# Altium project DeepPlankter_main.PrjPcb (part 1 of 2)
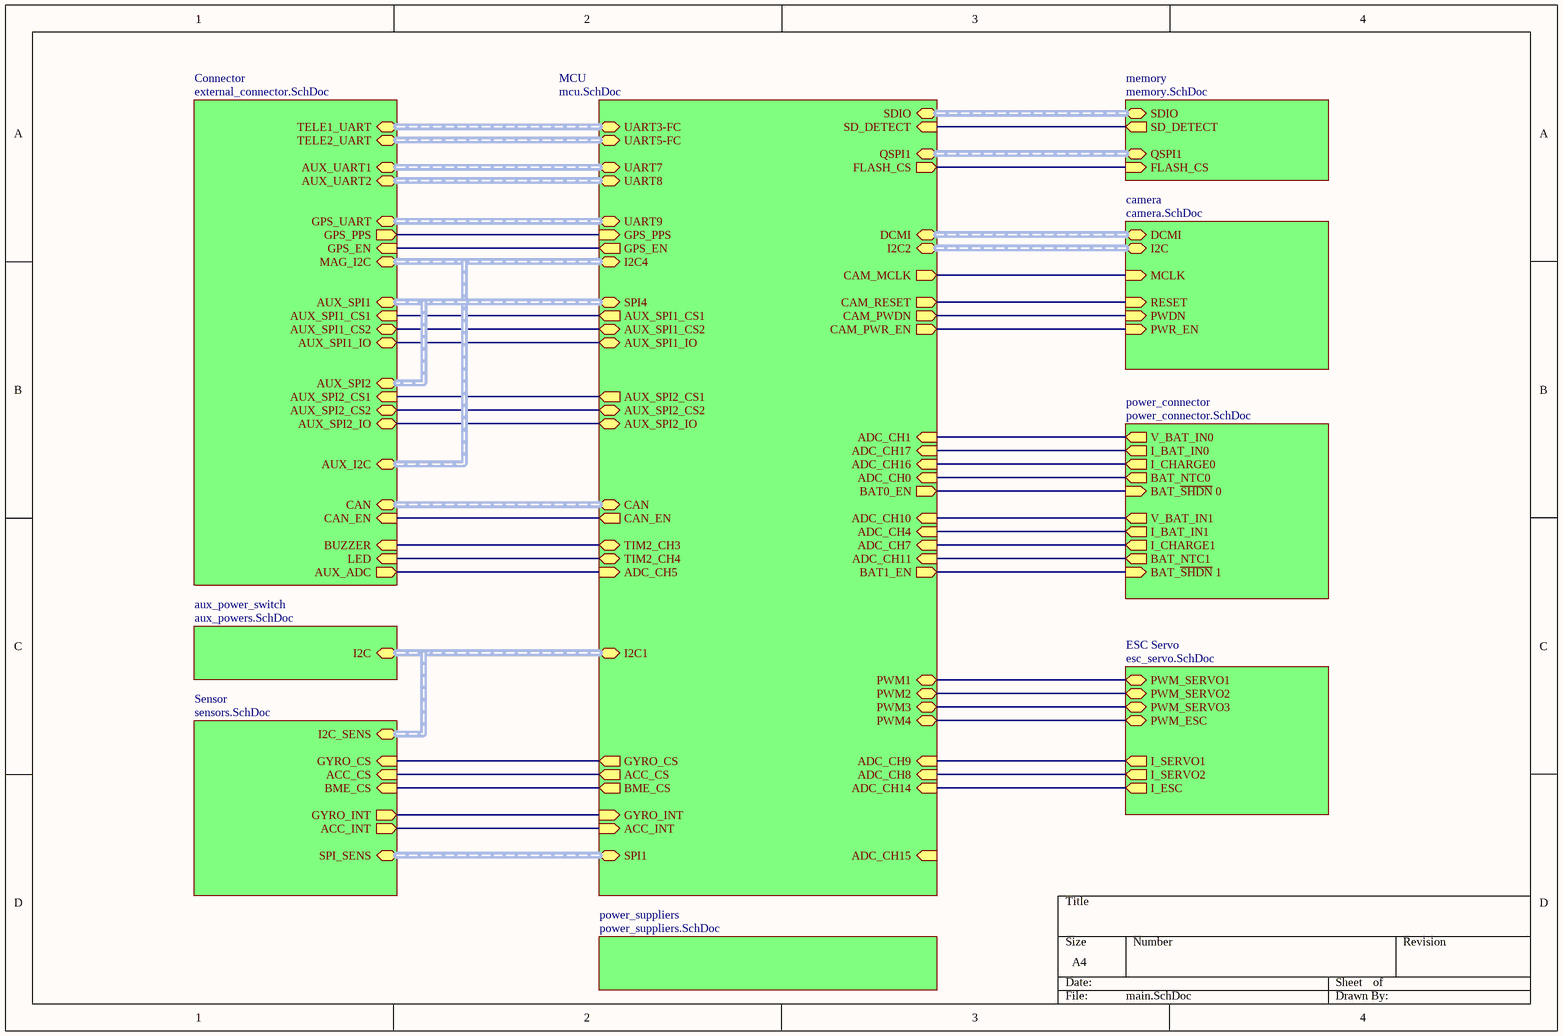
[diagram p0: main.SchDoc]
10 sheets, 257 parts. Net scope: hierarchical (ports join the sheet entries above them; power ports are global).
Board file: main.PcbDoc
Sheets:
  main.SchDoc
    MCU = mcu.SchDoc
    aux_power_switch = aux_powers.SchDoc
    Sensor = sensors.SchDoc
    Connector = external_connector.SchDoc
    power_connector = power_connector.SchDoc
    power_suppliers = power_suppliers.SchDoc
    memory = memory.SchDoc
    camera = camera.SchDoc
    ESC Servo = esc_servo.SchDoc

## Sheet main.SchDoc
size A4

### Sub-sheets
aux_power_switch = aux_powers.SchDoc: I2C (harness I2C)
camera = camera.SchDoc: DCMI (harness DCMI), RESET (in), PWDN (in), I2C (harness I2C), MCLK (in), PWR_EN (in)
Connector = external_connector.SchDoc: TELE2_UART (harness UART-FC), CAN_EN (in), AUX_UART1 (harness UART), TELE1_UART (harness UART-FC), BUZZER (in), GPS_PPS (out), MAG_I2C (harness I2C), AUX_UART2 (harness UART), AUX_I2C (harness I2C), AUX_SPI2_IO (bidir), AUX_SPI2 (harness SPI), AUX_SPI1_IO (bidir), GPS_UART (harness UART), CAN (harness CAN), AUX_SPI1 (harness SPI), GPS_EN (in), LED (in), AUX_ADC (out), AUX_SPI2_CS2 (bidir), AUX_SPI2_CS1 (in), AUX_SPI1_CS1 (in), AUX_SPI1_CS2 (bidir)
ESC Servo = esc_servo.SchDoc: I_SERVO1 (out), PWM_SERVO2, I_SERVO2 (out), PWM_ESC, I_ESC (out), PWM_SERVO1, PWM_SERVO3
MCU = mcu.SchDoc: UART5-FC (harness UART-FC), UART3-FC (harness UART-FC), UART7 (harness UART), UART8 (harness UART), UART9 (harness UART), I2C1 (harness I2C), I2C2 (harness I2C), I2C4 (harness I2C), SPI4 (harness SPI), SPI1 (harness SPI), SDIO (harness SDIO), DCMI (harness DCMI), ADC_CH14 (in), ADC_CH4 (in), ADC_CH11 (in), ADC_CH8 (in), CAN (harness CAN), CAM_RESET (out), CAM_PWDN (out), CAM_MCLK (out), CAM_PWR_EN (out), ADC_CH17 (in), ADC_CH16 (in), PWM4, PWM1, PWM3, PWM2, TIM2_CH3, TIM2_CH4, SD_DETECT (in), QSPI1 (harness QSPI), FLASH_CS (out), BAT0_EN (out), BAT1_EN (out), ADC_CH0 (in), ADC_CH10 (in), ADC_CH15 (in), ADC_CH1 (in), ADC_CH7 (in), ADC_CH5 (in), GPS_EN (out), GPS_PPS (in), AUX_SPI1_CS2 (bidir), AUX_SPI1_IO (bidir), AUX_SPI1_CS1 (out), AUX_SPI2_CS1 (out), AUX_SPI2_IO (bidir), AUX_SPI2_CS2 (bidir), CAN_EN (out), ACC_INT (in), GYRO_INT (in), ACC_CS (out), GYRO_CS (out), BME_CS (out), ADC_CH9 (in)
memory = memory.SchDoc: SDIO (harness SDIO), SD_DETECT (out), FLASH_CS (in), QSPI1 (harness QSPI)
power_connector = power_connector.SchDoc: I_CHARGE1 (out), V_BAT_IN1 (out), I_BAT_IN1 (out), BAT_NTC0 (out), I_CHARGE0 (out), V_BAT_IN0 (out), BAT_NTC1 (out), I_BAT_IN0 (out), BAT_~{SHDN} 1 (in), BAT_~{SHDN} 0 (in)
power_suppliers = power_suppliers.SchDoc: no entries
Sensor = sensors.SchDoc: GYRO_CS (in), ACC_CS (in), GYRO_INT (out), ACC_INT (out), SPI_SENS (harness SPI), I2C_SENS (harness I2C), BME_CS (in)

### Nets
ACC_CS: sheet MCU/ACC_CS, sheet Sensor/ACC_CS
ACC_INT: sheet MCU/ACC_INT, sheet Sensor/ACC_INT
ADC_CH0: sheet MCU/ADC_CH0, sheet power_connector/BAT_NTC0
ADC_CH1: sheet MCU/ADC_CH1, sheet power_connector/V_BAT_IN0
ADC_CH4: sheet MCU/ADC_CH4, sheet power_connector/I_BAT_IN1
ADC_CH5: sheet MCU/ADC_CH5, sheet Connector/AUX_ADC
ADC_CH7: sheet MCU/ADC_CH7, sheet power_connector/I_CHARGE1
ADC_CH8: sheet MCU/ADC_CH8, sheet ESC Servo/I_SERVO2
ADC_CH9: sheet MCU/ADC_CH9, sheet ESC Servo/I_SERVO1
ADC_CH10: sheet MCU/ADC_CH10, sheet power_connector/V_BAT_IN1
ADC_CH11: sheet MCU/ADC_CH11, sheet power_connector/BAT_NTC1
ADC_CH14: sheet MCU/ADC_CH14, sheet ESC Servo/I_ESC
ADC_CH16: sheet MCU/ADC_CH16, sheet power_connector/I_CHARGE0
ADC_CH17: sheet MCU/ADC_CH17, sheet power_connector/I_BAT_IN0
AUX_SPI1_CS1: sheet MCU/AUX_SPI1_CS1, sheet Connector/AUX_SPI1_CS1
AUX_SPI1_CS2: sheet MCU/AUX_SPI1_CS2, sheet Connector/AUX_SPI1_CS2
AUX_SPI1_IO: sheet MCU/AUX_SPI1_IO, sheet Connector/AUX_SPI1_IO
AUX_SPI2_CS1: sheet MCU/AUX_SPI2_CS1, sheet Connector/AUX_SPI2_CS1
AUX_SPI2_CS2: sheet MCU/AUX_SPI2_CS2, sheet Connector/AUX_SPI2_CS2
AUX_SPI2_IO: sheet MCU/AUX_SPI2_IO, sheet Connector/AUX_SPI2_IO
BAT0_EN: sheet MCU/BAT0_EN, sheet power_connector/BAT_~{SHDN} 0
BAT1_EN: sheet MCU/BAT1_EN, sheet power_connector/BAT_~{SHDN} 1
BME_CS: sheet MCU/BME_CS, sheet Sensor/BME_CS
BUZZER: sheet MCU/TIM2_CH3, sheet Connector/BUZZER
CAM_EN: sheet MCU/CAM_PWR_EN, sheet camera/PWR_EN
CAM_PWDN: sheet MCU/CAM_PWDN, sheet camera/PWDN
CAM_RESET: sheet MCU/CAM_RESET, sheet camera/RESET
CAN_EN: sheet MCU/CAN_EN, sheet Connector/CAN_EN
ESC_PWM: sheet MCU/PWM4, sheet ESC Servo/PWM_ESC
GPS_EN: sheet MCU/GPS_EN, sheet Connector/GPS_EN
GPS_PPS: sheet MCU/GPS_PPS, sheet Connector/GPS_PPS
GYRO_CS: sheet MCU/GYRO_CS, sheet Sensor/GYRO_CS
GYRO_INT: sheet MCU/GYRO_INT, sheet Sensor/GYRO_INT
LED: sheet MCU/TIM2_CH4, sheet Connector/LED
MCO_OUT: sheet MCU/CAM_MCLK, sheet camera/MCLK
QSPI1_FLASH_CS: sheet MCU/FLASH_CS, sheet memory/FLASH_CS
SD_DETECT: sheet MCU/SD_DETECT, sheet memory/SD_DETECT
SERVO1_PWM: sheet MCU/PWM1, sheet ESC Servo/PWM_SERVO1
SERVO2_PWM: sheet MCU/PWM2, sheet ESC Servo/PWM_SERVO2
SERVO3_PWM: sheet MCU/PWM3, sheet ESC Servo/PWM_SERVO3

### Buses and harness runs
harness sheet aux_power_switch/I2C = sheet MCU/I2C1 = sheet Sensor/I2C_SENS
harness sheet camera/DCMI = sheet MCU/DCMI
harness sheet camera/I2C = sheet MCU/I2C2
harness sheet Connector/AUX_I2C = sheet Connector/MAG_I2C = sheet MCU/I2C4
harness sheet Connector/AUX_SPI1 = sheet Connector/AUX_SPI2 = sheet MCU/SPI4
harness sheet Connector/AUX_UART1 = sheet MCU/UART7
harness sheet Connector/AUX_UART2 = sheet MCU/UART8
harness sheet Connector/CAN = sheet MCU/CAN
harness sheet Connector/GPS_UART = sheet MCU/UART9
harness sheet Connector/TELE1_UART = sheet MCU/UART3-FC
harness sheet Connector/TELE2_UART = sheet MCU/UART5-FC
harness sheet MCU/QSPI1 = sheet memory/QSPI1
harness sheet MCU/SDIO = sheet memory/SDIO
harness sheet MCU/SPI1 = sheet Sensor/SPI_SENS

## Sheet mcu.SchDoc
size A3
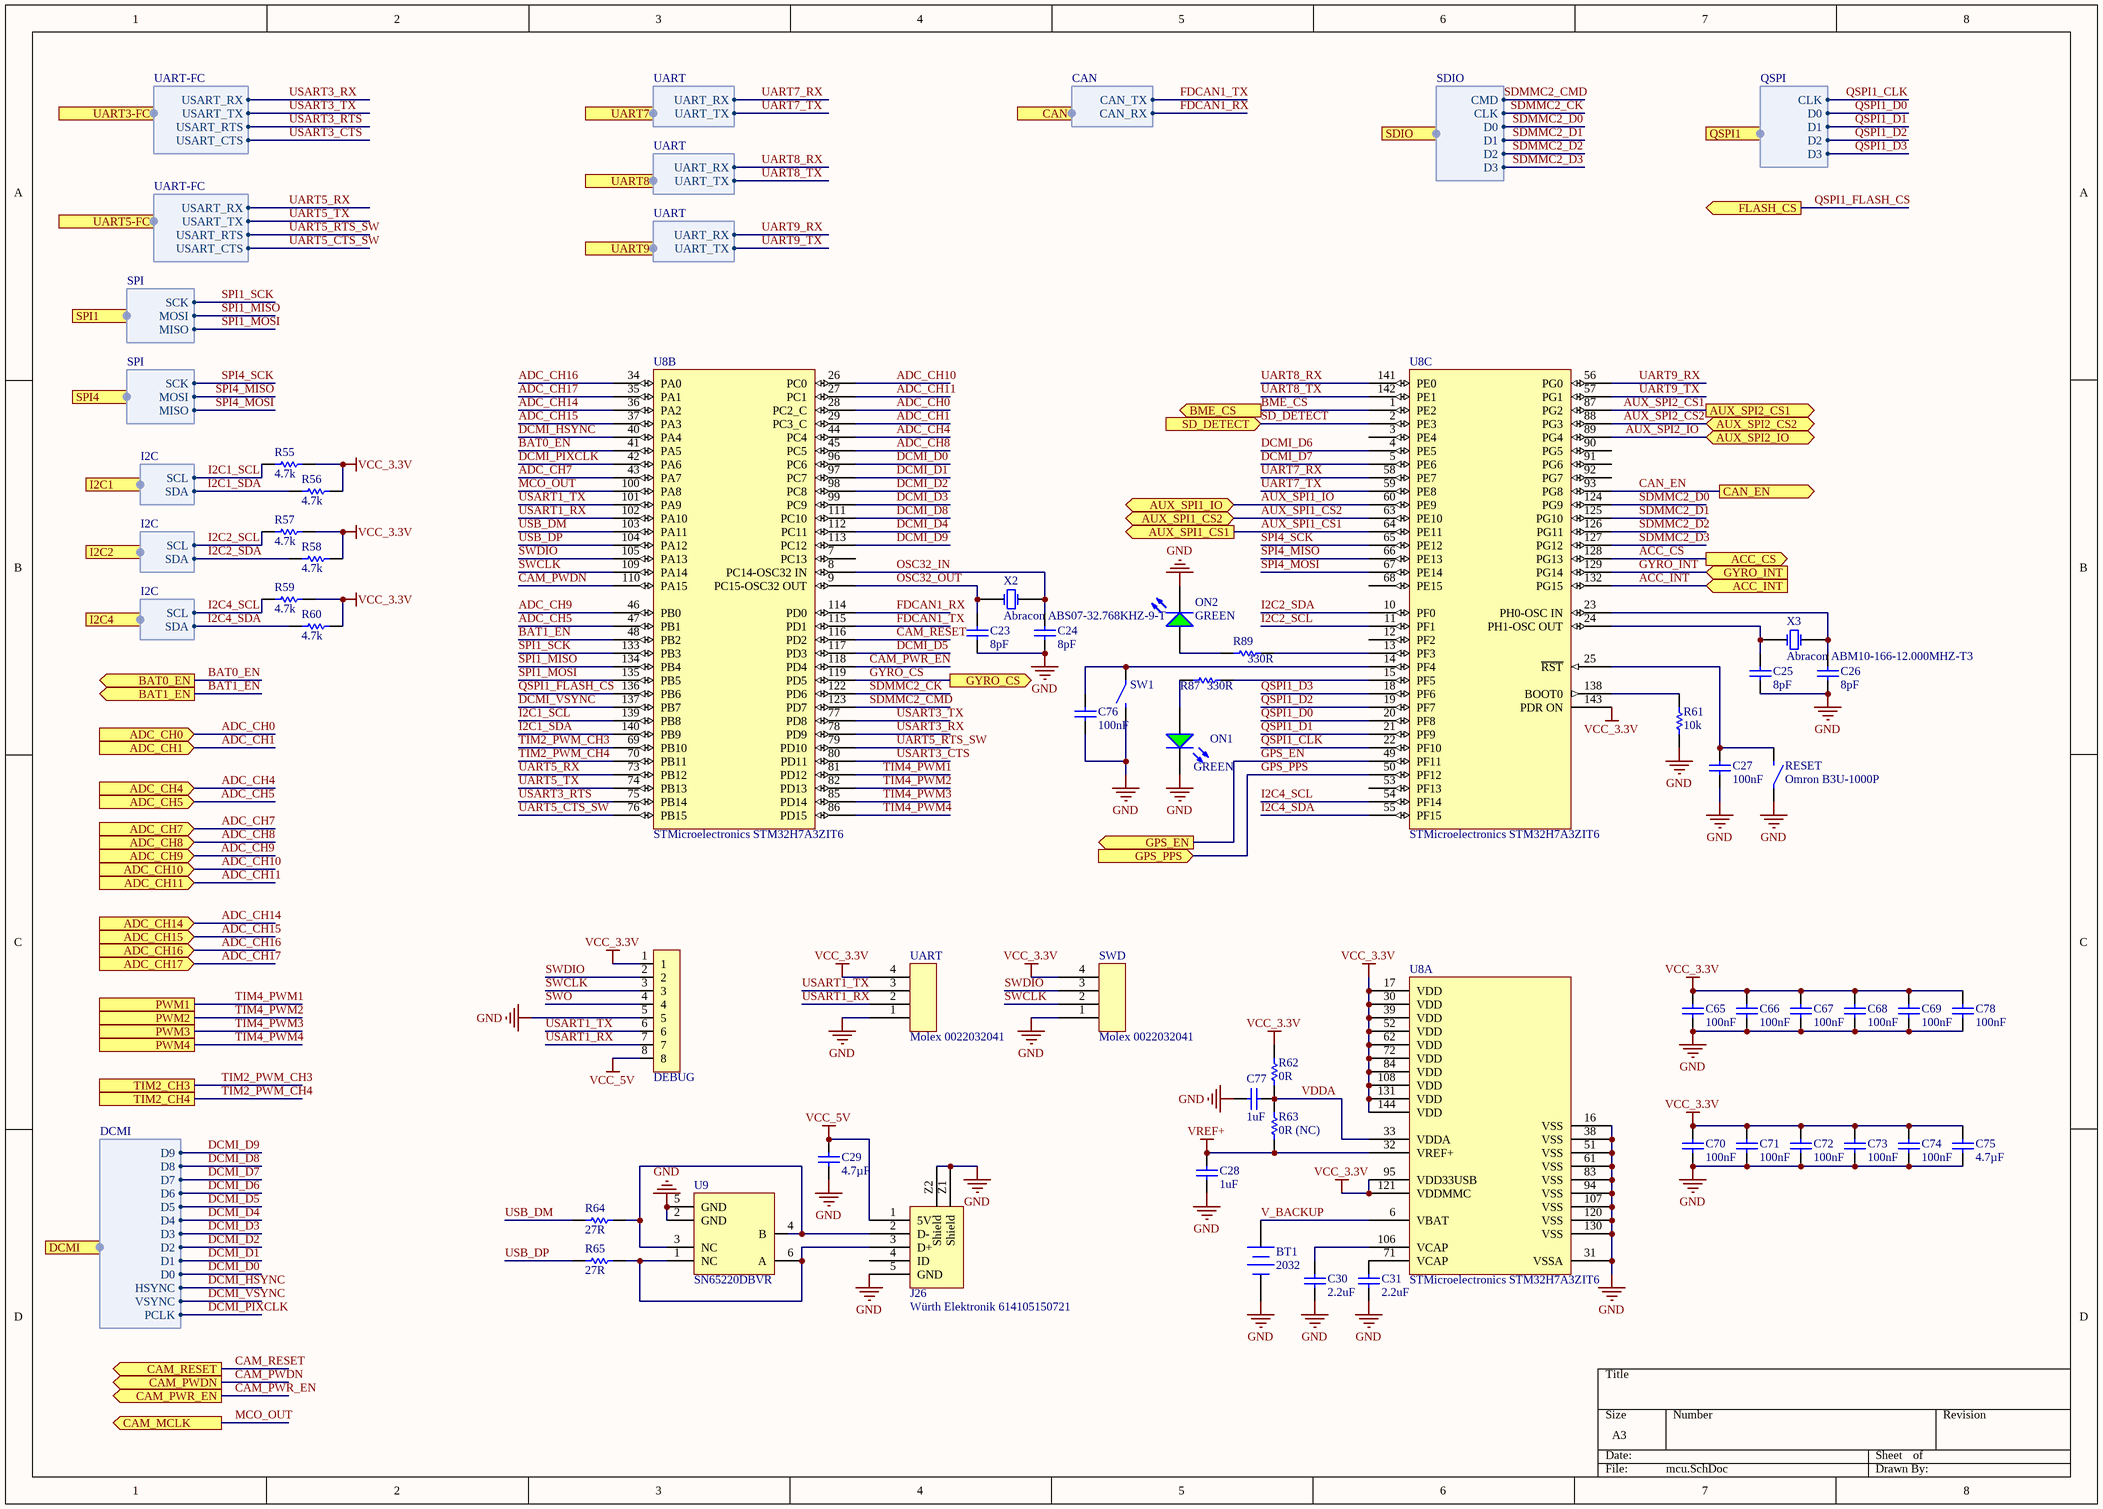
[diagram p1: mcu.SchDoc]

### Parts
BT1  2032  [PCB-u4kor45r34oj4lfal23t-1]
C23  8pF  [CAPC1005X55X25NL05T10]
C24  8pF  [CAPC1005X55X25NL05T10]
C25  8pF  [CAPC1005X55X25NL05T10]
C26  8pF  [CAPC1005X55X25NL05T10]
C27  100nF  [CAPC1005X56X25NL10T15]
C28  1uF  [CAPC1005X60X30LL05T10]
C29  4.7µF  [CAPC1608X90X35NL15T15]
C30  2.2uF  [CAPC1005X56X25LL10T15]
C31  2.2uF  [CAPC1005X56X25LL10T15]
C65  100nF  [CAPC1005X56X25NL10T15]
C66  100nF  [CAPC1005X56X25NL10T15]
C67  100nF  [CAPC1005X56X25NL10T15]
C68  100nF  [CAPC1005X56X25NL10T15]
C69  100nF  [CAPC1005X56X25NL10T15]
C70  100nF  [CAPC1005X56X25NL10T15]
C71  100nF  [CAPC1005X56X25NL10T15]
C72  100nF  [CAPC1005X56X25NL10T15]
C73  100nF  [CAPC1005X56X25NL10T15]
C74  100nF  [CAPC1005X56X25NL10T15]
C75  4.7µF  [CAPC1608X90X35NL15T15]
C76  100nF  [CAPC1005X56X25NL10T15]
C77  1uF  [CAPC1005X60X30LL05T10]
C78  100nF  [CAPC1005X56X25NL10T15]
DEBUG  FCI HLW8R-2C7LF  [PCB-9fz4gdy3o615agpn7s9f-1]  (value not drawn)
J26  Würth Elektronik 614105150721  [USB connector B]
ON1  GREEN  [LED-0603_D]
ON2  GREEN  [LED-0603_D]
R55  4.7k  [RESC1005X40X25NL10T10]
R56  4.7k  [RESC1005X40X25NL10T10]
R57  4.7k  [RESC1005X40X25NL10T10]
R58  4.7k  [RESC1005X40X25NL10T10]
R59  4.7k  [RESC1005X40X25NL10T10]
R60  4.7k  [RESC1005X40X25NL10T10]
R61  10k  [RESC1005X40X25NL05T10]
R62  0R  [PCB-azzhouwj1h0sqqpj65ny-1]
R63  0R (NC)  [PCB-azzhouwj1h0sqqpj65ny-1]
R64  27R  [RESC1005X40X25NL05T05]
R65  27R  [RESC1005X40X25NL05T05]
R87  330R  [PCB-gqq469mmsoijq124jywu-1]
R89  330R  [PCB-gqq469mmsoijq124jywu-1]
RESET  Omron B3U-1000P  [PCB-a8ildroimidtkya2dspy-1]
SW1  Omron B3U-1000P  [PCB-a8ildroimidtkya2dspy-1]  (value not drawn)
SWD  Molex 0022032041  [PCB-w7fgx0p37qyww1etoafk-1]
U8  STMicroelectronics STM32H7A3ZIT6  [PCB-qnuz4odb3kjwuv0h32wq-1]  (parts A,B,C of 3)
U9  SN65220DBVR  [DBV6_M]
UART  Molex 0022032041  [PCB-w7fgx0p37qyww1etoafk-1]
X2  Abracon ABS07-32.768KHZ-9-T  [CAPC3215X09N]
X3  Abracon ABM10-166-12.000MHZ-T3  [PCBComponent_1 - duplicate]

### Ports
ACC_CS (out), ACC_INT (in), ADC_CH0 (in), ADC_CH1 (in), ADC_CH4 (in), ADC_CH5 (in), ADC_CH7 (in), ADC_CH8 (in), ADC_CH9 (in), ADC_CH10 (in), ADC_CH11 (in), ADC_CH14 (in), ADC_CH15 (in), ADC_CH16 (in), ADC_CH17 (in), AUX_SPI1_CS1 (out), AUX_SPI1_CS2 (bidir), AUX_SPI1_IO (bidir), AUX_SPI2_CS1 (out), AUX_SPI2_CS2 (bidir), AUX_SPI2_IO (bidir), BAT0_EN (out), BAT1_EN (out), BME_CS (out), CAM_MCLK (out), CAM_PWDN (out), CAM_PWR_EN (out), CAM_RESET (out), CAN (harness CAN), CAN_EN (out), DCMI (harness DCMI), FLASH_CS (out), GPS_EN (out), GPS_PPS (in), GYRO_CS (out), GYRO_INT (in), I2C1 (harness I2C), I2C2 (harness I2C), I2C4 (harness I2C), PWM1, PWM2, PWM3, PWM4, QSPI1 (harness QSPI), SD_DETECT (in), SDIO (harness SDIO), SPI1 (harness SPI), SPI4 (harness SPI), TIM2_CH3, TIM2_CH4, UART3-FC (harness UART-FC), UART5-FC (harness UART-FC), UART7 (harness UART), UART8 (harness UART), UART9 (harness UART)

### Harnesses
DCMI: PCLK, VSYNC, HSYNC, D0, D1, D2, D3, D4, D5, D6, D7, D8, D9
I2C: SCL, SDA
SPI: MOSI, MISO, SCK
UART-FC: USART_TX, USART_RX, USART_CTS, USART_RTS
UART: UART_TX, UART_RX
CAN: CAN_TX, CAN_RX
SDIO: CLK, CMD, D0, D1, D2, D3
QSPI: CLK, D0, D1, D2, D3

### Nets
GND: BT1.2(-) C23.2 C24.2 C25.2 C26.2 C27.1 C28.1 C29.2 C30.1 C31.1 C65.2 C66.2 C67.2 C68.2 C69.2 C70.2 C71.2 C72.2 C73.2 C74.2 C75.1 C76.1 C77.2 C78.2 DEBUG.5 J26.5(GND) J26.Z1(Shield) J26.Z2(Shield) ON1.C ON2.C R61.1 RESET.1 SW1.2 SWD.1 U8.16(VSS) U8.31(VSSA) U8.38(VSS) U8.51(VSS) U8.61(VSS) U8.83(VSS) U8.94(VSS) U8.107(VSS) U8.120(VSS) U8.130(VSS) U9.2(GND) U9.5(GND) UART.1
VCC_3.3V: C65.1 C66.1 C67.1 C68.1 C69.1 C70.1 C71.1 C72.1 C73.1 C74.1 C75.2 C78.1 DEBUG.1 R55.2 R56.2 R57.2 R58.2 R59.2 R60.2 R62.2 SWD.4 U8.17(VDD) U8.30(VDD) U8.39(VDD) U8.52(VDD) U8.62(VDD) U8.72(VDD) U8.84(VDD) U8.95(VDD33USB) U8.108(VDD) U8.121(VDDMMC) U8.131(VDD) U8.143(PDR_ON) U8.144(VDD) UART.4
VCC_5V: C29.1 DEBUG.8 J26.1(5V)
VREF+: C28.2 R63.2 U8.32(VREF+)
ACC_CS: U8.128(PG13) ; port ACC_CS
ACC_INT: U8.132(PG15) ; port ACC_INT
ADC_CH0: U8.28(PC2_C) ; port ADC_CH0
ADC_CH1: U8.29(PC3_C) ; port ADC_CH1
ADC_CH4: U8.44(PC4) ; port ADC_CH4
ADC_CH5: U8.47(PB1) ; port ADC_CH5
ADC_CH7: U8.43(PA7) ; port ADC_CH7
ADC_CH8: U8.45(PC5) ; port ADC_CH8
ADC_CH9: U8.46(PB0) ; port ADC_CH9
ADC_CH10: U8.26(PC0) ; port ADC_CH10
ADC_CH11: U8.27(PC1) ; port ADC_CH11
ADC_CH14: U8.36(PA2) ; port ADC_CH14
ADC_CH15: U8.37(PA3) ; port ADC_CH15
ADC_CH16: U8.34(PA0) ; port ADC_CH16
ADC_CH17: U8.35(PA1) ; port ADC_CH17
AUX_SPI1_CS1: U8.64(PE11) ; port AUX_SPI1_CS1
AUX_SPI1_CS2: U8.63(PE10) ; port AUX_SPI1_CS2
AUX_SPI1_IO: U8.60(PE9) ; port AUX_SPI1_IO
AUX_SPI2_CS1: U8.87(PG2) ; port AUX_SPI2_CS1
AUX_SPI2_CS2: U8.88(PG3) ; port AUX_SPI2_CS2
AUX_SPI2_IO: U8.89(PG4) ; port AUX_SPI2_IO
BAT0_EN: U8.41(PA5) ; port BAT0_EN
BAT1_EN: U8.48(PB2) ; port BAT1_EN
BME_CS: U8.1(PE2) ; port BME_CS
CAM_PWDN: U8.110(PA15) ; port CAM_PWDN
CAM_PWR_EN: U8.118(PD4) ; port CAM_PWR_EN  [project net CAM_EN]
CAM_RESET: U8.116(PD2) ; port CAM_RESET
CAN_EN: U8.93(PG8) ; port CAN_EN
DCMI_D0: U8.96(PC6) ; port DCMI.D0  [project net D0]
DCMI_D1: U8.97(PC7) ; port DCMI.D1  [project net D1]
DCMI_D2: U8.98(PC8) ; port DCMI.D2  [project net D2]
DCMI_D3: U8.99(PC9) ; port DCMI.D3  [project net D3]
DCMI_D4: U8.112(PC11) ; port DCMI.D4  [project net D4]
DCMI_D5: U8.117(PD3) ; port DCMI.D5  [project net D5]
DCMI_D6: U8.4(PE5) ; port DCMI.D6  [project net D6]
DCMI_D7: U8.5(PE6) ; port DCMI.D7  [project net D7]
DCMI_D8: U8.111(PC10) ; port DCMI.D8  [project net D8]
DCMI_D9: U8.113(PC12) ; port DCMI.D9  [project net D9]
DCMI_HSYNC: U8.40(PA4) ; port DCMI.HSYNC
DCMI_PIXCLK: U8.42(PA6) ; port DCMI.PCLK
DCMI_VSYNC: U8.137(PB7) ; port DCMI.VSYNC
FDCAN1_RX: U8.114(PD0) ; port CAN.CAN_RX
FDCAN1_TX: U8.115(PD1) ; port CAN.CAN_TX
GPS_EN: U8.49(PF11) ; port GPS_EN
GPS_PPS: U8.50(PF12) ; port GPS_PPS
GYRO_CS: U8.119(PD5) ; port GYRO_CS
GYRO_INT: U8.129(PG14) ; port GYRO_INT
I2C1_SCL: R55.1 U8.139(PB8) ; port I2C1.SCL
I2C1_SDA: R56.1 U8.140(PB9) ; port I2C1.SDA
I2C2_SCL: R57.1 U8.11(PF1) ; port I2C2.SCL
I2C2_SDA: R58.1 U8.10(PF0) ; port I2C2.SDA
I2C4_SCL: R59.1 U8.54(PF14) ; port I2C4.SCL  [project net AUX_I2C_SCL]
I2C4_SDA: R60.1 U8.55(PF15) ; port I2C4.SDA  [project net AUX_I2C_SDA]
MCO_OUT: U8.100(PA8) ; port CAM_MCLK
OSC32_IN: C24.1 U8.8(PC14-OSC32_IN) X2.2(X2)
OSC32_OUT: C23.1 U8.9(PC15-OSC32_OUT) X2.1(X1)
QSPI1_CLK: U8.22(PF10) ; port QSPI1.CLK
QSPI1_D0: U8.20(PF8) ; port QSPI1.D0
QSPI1_D1: U8.21(PF9) ; port QSPI1.D1
QSPI1_D2: U8.19(PF7) ; port QSPI1.D2
QSPI1_D3: U8.18(PF6) ; port QSPI1.D3
QSPI1_FLASH_CS: U8.136(PB6) ; port FLASH_CS
SD_DETECT: U8.2(PE3) ; port SD_DETECT
SDMMC2_CK: U8.122(PD6) ; port SDIO.CLK  [project net SDIO_CLK]
SDMMC2_CMD: U8.123(PD7) ; port SDIO.CMD  [project net SDIO_CMD]
SDMMC2_D0: U8.124(PG9) ; port SDIO.D0  [project net SDIO_D0]
SDMMC2_D1: U8.125(PG10) ; port SDIO.D1  [project net SDIO_D1]
SDMMC2_D2: U8.126(PG11) ; port SDIO.D2  [project net SDIO_D2]
SDMMC2_D3: U8.127(PG12) ; port SDIO.D3  [project net SDIO_D3]
SPI1_MISO: U8.134(PB4) ; port SPI1.MOSI  [project net MOSI]
SPI1_MOSI: U8.135(PB5) ; port SPI1.MISO  [project net MISO]
SPI1_SCK: U8.133(PB3) ; port SPI1.SCK  [project net SCK]
SPI4_MISO: U8.66(PE13) ; port SPI4.MOSI  [project net AUX_SPI1_MOSI]
SPI4_MOSI: U8.67(PE14) ; port SPI4.MISO  [project net AUX_SPI1_MISO]
SPI4_SCK: U8.65(PE12) ; port SPI4.SCK  [project net AUX_SPI1_SCK]
SWCLK: DEBUG.3 SWD.2 U8.109(PA14)
SWDIO: DEBUG.2 SWD.3 U8.105(PA13)
SWO: DEBUG.4
TIM2_PWM_CH3: U8.69(PB10) ; port TIM2_CH3  [project net BUZZER]
TIM2_PWM_CH4: U8.70(PB11) ; port TIM2_CH4  [project net LED]
TIM4_PWM1: U8.81(PD12) ; port PWM1  [project net SERVO1_PWM]
TIM4_PWM2: U8.82(PD13) ; port PWM2  [project net SERVO2_PWM]
TIM4_PWM3: U8.85(PD14) ; port PWM3  [project net SERVO3_PWM]
TIM4_PWM4: U8.86(PD15) ; port PWM4  [project net ESC_PWM]
UART5_CTS_SW: U8.76(PB15) ; port UART5-FC.USART_CTS  [project net TELE2_USART_RTS]
UART5_RTS_SW: U8.79(PD10) ; port UART5-FC.USART_RTS  [project net TELE2_USART_CTS]
UART5_RX: U8.73(PB12) ; port UART5-FC.USART_RX  [project net TELE2_USART_TX]
UART5_TX: U8.74(PB13) ; port UART5-FC.USART_TX  [project net TELE2_USART_RX]
UART7_RX: U8.58(PE7) ; port UART7.UART_RX  [project net AUX_UART1_TX]
UART7_TX: U8.59(PE8) ; port UART7.UART_TX  [project net AUX_UART1_RX]
UART8_RX: U8.141(PE0) ; port UART8.UART_RX  [project net AUX_UART2_TX]
UART8_TX: U8.142(PE1) ; port UART8.UART_TX  [project net AUX_UART2_RX]
UART9_RX: U8.56(PG0) ; port UART9.UART_RX  [project net GPS_TX]
UART9_TX: U8.57(PG1) ; port UART9.UART_TX  [project net GPS_RX]
USART1_RX: DEBUG.7 U8.102(PA10) UART.2
USART1_TX: DEBUG.6 U8.101(PA9) UART.3
USART3_CTS: U8.80(PD11) ; port UART3-FC.USART_CTS  [project net TELE1_USART_RTS]
USART3_RTS: U8.75(PB14) ; port UART3-FC.USART_RTS  [project net TELE1_USART_CTS]
USART3_RX: U8.78(PD9) ; port UART3-FC.USART_RX  [project net TELE1_USART_TX]
USART3_TX: U8.77(PD8) ; port UART3-FC.USART_TX  [project net TELE1_USART_RX]
USB_DM: R64.1 U8.103(PA11)
USB_DP: R65.1 U8.104(PA12)
V_BACKUP: BT1.1(+) U8.6(VBAT)
VDDA: C77.1 R62.1 R63.1 U8.33(VDDA)
NetC25_1: C25.1 U8.24(PH1-OSC_OUT) X3.3(X2)
NetC26_1: C26.1 U8.23(PH0-OSC_IN) X3.1(X1)
NetC27_2: C27.2 RESET.2 U8.25(~{RST})
NetC30_2: C30.2 U8.106(VCAP)
NetC31_2: C31.2 U8.71(VCAP)
NetC76_2: C76.2 SW1.1 U8.14(PF4)
NetJ26_2: J26.2(D-) R64.2 U9.3(NC) U9.4(B)
NetJ26_3: J26.3(D+) R65.2 U9.1(NC) U9.6(A)
NetON1_A: ON1.A R87.2
NetON2_A: ON2.A R89.2
NetR61_2: R61.2 U8.138(BOOT0)
NetR87_1: R87.1 U8.15(PF5)
NetR89_1: R89.1 U8.13(PF3)

Not connected (* = marked no-connect by the designer): J26 4(ID); U8 3(PE4) 7(PC13) 12(PF2) 53(PF13) 68(PE15) 90(PG5) 91(PG6) 92(PG7)

### Library data of the parts
BT1 = CMP-19301741-10: Coin Cell Battery Holders 20MM (2032) SMT CELL HOLDER
C23-C26 = CMP-137744-2: CAP CER 8PF 50V NP0 0402; Manufacturer Part Number: GJM1555C1H8R0WB01D; Capacitance: 8e-12 F; Dielectric Characteristic: C0G/NP0; Voltage Rating (DC): 50.0 V; Octopart Url: https://octopart.com/gjm1555c1h8r0wb01d-murata-18142773; OctopartID: 2584ed9ad6d7fa43; RoHS: Compliant; Size-Length: 0.001 m; Size-Thickness: 0.0005 m; Size-Width: 0.0005 m
C27 C65-C74 C76 C78 = CMP-bf2276a55d9a60e5-19: Ceramic capacitor SMD-0402 100nF /16V X7R# K +-10%, Samsung, RoHS; Dielectric Characteristic: X7R; Lead-Free Status: Lead Free; Mounting Style: Surface Mount; Capacitance: 100 nF; Case/Package: 0402; OctopartID: 0755ced2c795d892
C28 C77 = CMP-8752271-2: Cap Ceramic 1uF 10V X5R 10% SMD 0402 85C Paper T/R; Manufacturer Part Number: C0402C105K8PACTU; Capacitance: 1e-06 F; Lead-Free Status: Lead Free; Voltage Rating (DC): 10.0 V; Capacitance Tolerance: ±10%; Case/Package: 0402; Dielectric Characteristic: X5R; Dielectric Material: Ceramic; Mounting Style: Surface Mount; Octopart Url: https://octopart.com/c0402c105k8pac7867-kemet-1869581; OctopartID: 270dee1b8566f8ca; RoHS: Compliant
C29 C75 = CMP-147010-6: 0603 4.7 uF 10 V ±10 % Tolerance X5R SMT Multilayer Ceramic Capacitor; Voltage Rating (DC): 10.0 V; Capacitance Tolerance: ±10%; Lead-Free Status: Lead Free; Capacitance: 4.70 µF; Operating Temperature: -55.0 °C to 85.0 °C; Dielectric Characteristic: X5R; OctopartID: 876b4eec68d658ac; Octopart URL: https://octopart.com/cc0603krx5r6bb475-yageo-9292507; Number of Pins: 2; Mounting Style: Surface Mount; RoHS: Compliant
C30 C31 = CMP-954275-2: AVX   04026D225KAT2A   CAP, MLCC, X5R, 2.2UF, 6.3V, 0402; Capacitance: 2.2e-06 F; Capacitance Tolerance: ±10%; Lead-Free Status: Lead Free; Manufacturer Part Number: 04026D225KAT2A; Case/Package: 0402; Dielectric Characteristic: X5R; Mounting Style: Surface Mount; Number of Pins: 2; Octopart Url: https://octopart.com/04026d225kat2a-avx+interconnect+%2F+elco-18781101; OctopartID: b6d37ec700186914; REACH SVHC Compliance: No SVHC; RoHS: Compliant; Voltage Rating (DC): 6.3 V
DEBUG = CMP-90945c3aea634f53-1: FPC Connector; 0.5mm pitch dual contactback flip FPC; 8pos; Contact Material: Copper Alloy; RoHS: Compliant; Octopart URL: https://octopart.com/2328702-8-te+connectivity-94658449
J26 = CMP-3a62f04b53f2e5a5-1: Vertical Through Hole; Ver 2.0 Micro USB Connector Socket; 30 V ac; 1.8A WR-COM; Gender: Female; Number of Contacts: 5; Operating Voltage: 30.0 V; Current Rating: 1.80 A; Contact Material: Copper Alloy; RoHS: Compliant; Mounting Style: Through Hole; OctopartID: 3a62f04b53f2e5a5; Contact Plating: Gold; Orientation: Vertical; Operating Temperature: -40.0 °C (min); Octopart URL: https://octopart.com/614105150621-w%C3%BCrth+elektronik-52645110
ON1 ON2 = CMP-65d2acda0cfcba15-1.A.3: Super Ultra Green 0603 1.6 x 0.8 mm 140° Diffused 45 mcd 2.2 V PCB Chip SMT LED; Manufacturer Part Number: SML-LX0603SUGW-TR; Forward Voltage: 2.20 V; Wavelength: 574 nm; Lead-Free Status: Lead Free; Luminous Intensity: 45.0 mcd; Number of Pins: 2; Packaging: Cut Tape (CT), Tape & Reel (TR); Seller Landing  Url: https://octopart-clicks.com/click/track?country=US&ak=8157f166&sig=056782a&sid=459&ppid=150600&vpid=1262106&ct=offers; Color: Green; Size-Width: 1.60 mm; Viewing Angle: 140 °; Octopart Url: http://octopart.com/sml-lx0603sugw-tr-lumex-150600; RoHS: Compliant
R55-R60 = CMP-3660836-2: Thick Film Resistors - SMD 1/16watt 4.7Kohms 1%; Manufacturer Part Number: RK73H1ETTP4701F; Lead-Free Status: Lead Free; Power Rating: 0.063 W; Resistance: 4700.0 Ω; Case/Package: 0402; Octopart Url: https://octopart.com/rk73h1ettp4701f-koa+speer-7463891; OctopartID: 60e3a998a656bf24; Resistance Tolerance: ±1%; RoHS: Compliant
R61 = CMP-3661304-2: Thick Film Resistors - SMD 10K OHM 1%; Manufacturer Part Number: RC0402FR-1310KL; Lead-Free Status: Lead Free; Power Rating: 0.0625 W; Resistance: 10000.0 Ω; Voltage Rating (DC): 50.0 V; Case/Package: 0402; Mounting Style: Surface Mount; Number of Pins: 2; Octopart Url: https://octopart.com/rc0402fr-1310kl-yageo-42863452; OctopartID: f5673ee3db5d2aa0; Packaging: Cut Tape (CT); Resistance Tolerance: ±1%; RoHS: Compliant; Size-Length: 0.001 m
R62 R63 = CMP-13527731-11: RC Series 0402 0.063 W 0 Ohms Jumper Surface Mount Thick Film Chip Resistor; Temperature Coefficient: -250 ppm/°C to 250 ppm/°C; RoHS: Compliant; Packaging: Tape & Reel; Number of Pins: 2; Size-Width: 500 µm; OctopartID: 3abff0f8c341e578
R64 R65 = CMP-3855807-2: RES SMD 27 OHM 1% 1/16W 0402; Manufacturer Part Number: CRCW040227R0FKED; Lead-Free Status: Lead Free; Power Rating: 0.063 W; Resistance: 27.0 Ω; Voltage Rating (DC): 50.0 V; Case/Package: 0402; Mounting Style: Surface Mount; Number of Pins: 2; Octopart Url: https://octopart.com/crcw040227r0fked-vishay-39846192; OctopartID: 351cfe76114aeadb; REACH SVHC Compliance: No SVHC; Resistance Tolerance: ±1%; RoHS: Compliant; Size-Height: 0.00035 m; Size-Length: 0.001 m; Size-Width: 0.0005 m
R87 R89 = CMP-1852941-7: Res General Purpose Thick Film 0603 330 Ohm 5% 1/10W ±100ppm/°C Molded SMD Paper T/R; Manufacturer Part Number: RC0603JR-07330RL; Case/Package (SI): 1608; Temperature Coefficient: -100 ppm/°C to 100 ppm/°C; Resistance: 330 Ω; Power Rating: 100 mW; Octopart URL: https://octopart.com/rc0603jr-07330rl-yageo-39803615; Size-Height: 450 µm; RoHS: Compliant; Resistance Tolerance: ±5%; Packaging: Tape & Reel; Number of Pins: 2; Mounting Style: Surface Mount; Operating Temperature: 155 °C (max); Size-Width: 800 µm; OctopartID: 0b82c0d7743bd445; Case/Package: 0603
RESET SW1 = CMP-2198857-15: Switch Tactile N.O. SPST Round Button Gull Wing 0.05A 12VDC 1.5N SMD Embossed T/R; Contact Resistance: 100 m?; Lead-Free Status: Lead Free; Actuator Type: Top Plunger; Contacts Type: SPST-NO; RoHS: Compliant; Octopart URL: http://octopart.com/b3u-1000p-omron-1057357; REACH SVHC Compliance: No SVHC; Orientation: Vertical; Insulation Resistance: 100 M?; Mounting Style: Surface Mount; Manufacturer Part Number: B3U-1000P; OctopartID: 24bceda62397fb7b
SWD UART = CMP-4df18464dcf59236-7: Conn Unshrouded Header HDR 4 POS 2.54mm Solder ST Thru-Hole KK?? Bag
U8 = CMP-79c4b6aa4662a603-3: STM32H Series 2 MB Flash 1.4 MB SRAM 280 MHz 32-Bit Microcontroller - LQFP-144; OctopartID: 79c4b6aa4662a603; Manufacturer Part Number: STM32H7A3ZIT6; Lifecycle Status: Active; Octopart URL: https://octopart.com/stm32h7a3zit6-stmicroelectronics-107223744
U9 = CMP-13588204-2: Single Universal Serial Bus Port Transient Suppressor, 2 Channels, -40 to +85 degC, 6-pin SOT-23 (DBV), Green (RoHS & no Sb/Br); Breakdown Voltage: 7.0 V; Capacitance: 3.5e-11 F; Lead-Free Status: Lead Free; Number of Channels: 2; Operating Voltage: 6.0 V; Power Dissipation: 0.385 W; Manufacturer Part Number: SN65220DBVR; Case/Package: SOT-23; Lifecycle Status: Active; Mounting Style: Surface Mount; Number of Pins: 6; Octopart Url: https://octopart.com/sn65220dbvr-texas+instruments-519897; OctopartID: 691ea013a2a1b6d9; REACH SVHC Compliance: No SVHC; RoHS: Compliant
X2 = CMP-ab256225872974e2-3: ABS07 Series 32.768 kHz ±20 ppm 9 pF -40 to +85 °C SMT Low Profile Crystal; Lead-Free Status: Lead Free; Load Capacitance: 9.00 pF; OctopartID: ab256225872974e2; RoHS: Compliant
X3 = CMP-ad1c606f542d72db-7: Crystal 12.00mhz 8pf Low Esr Smd 2.5x2.0

## Sheet aux_powers.SchDoc
size A4
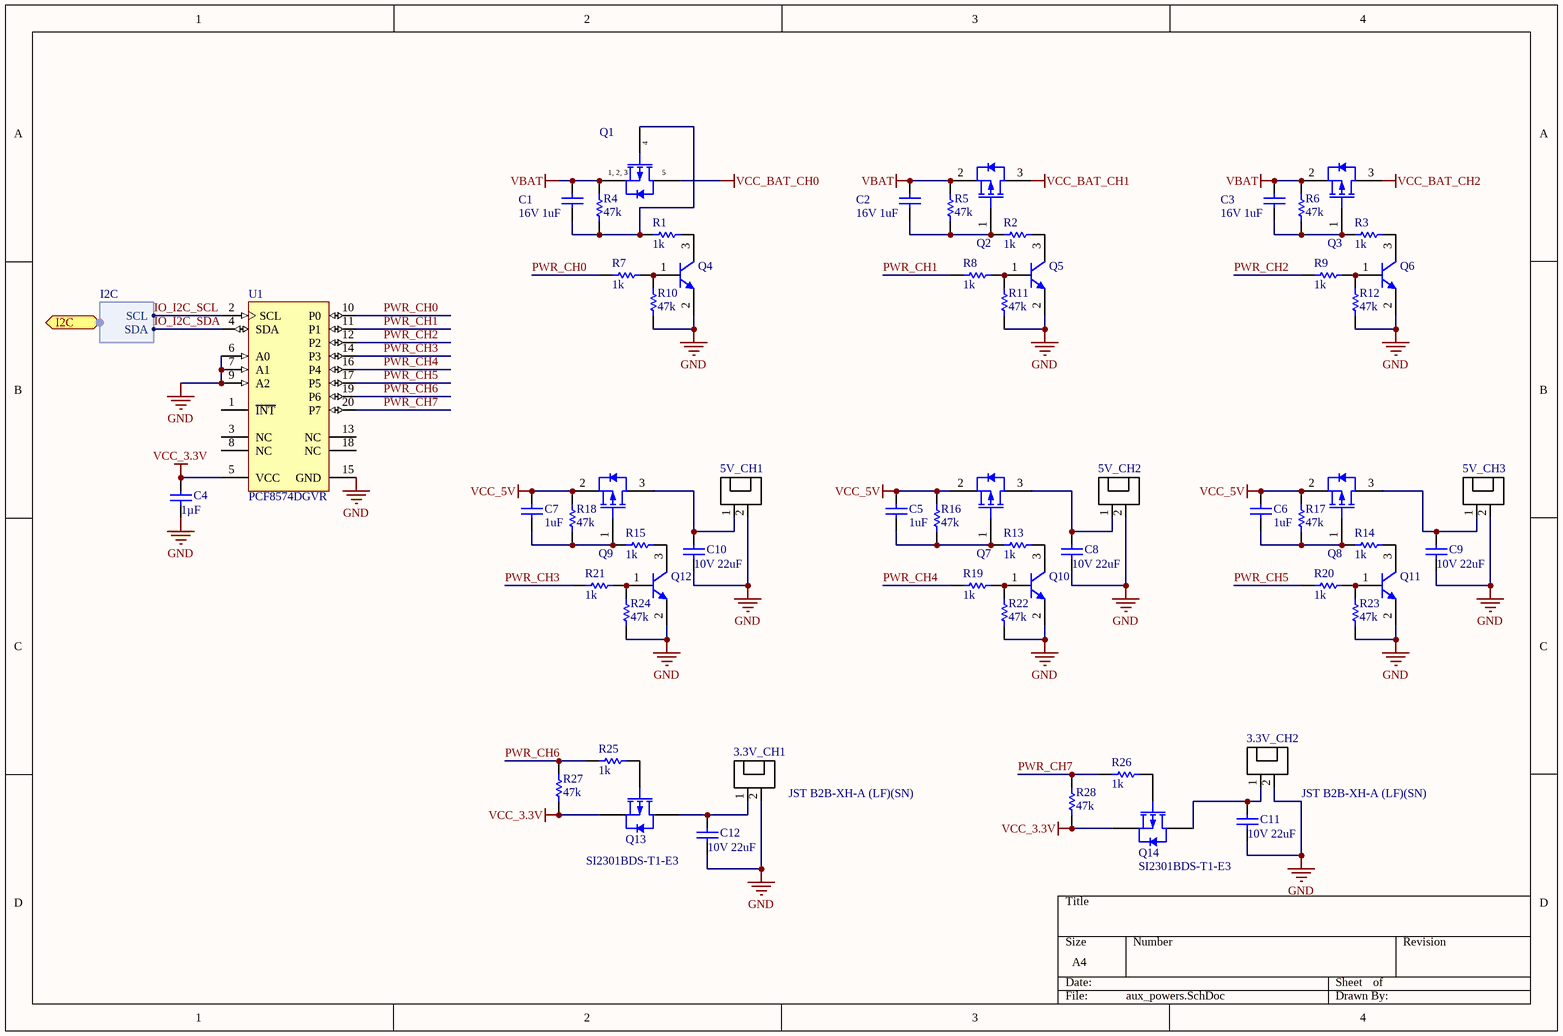
[diagram p2: aux_powers.SchDoc]

### Parts
3.3V_CH1  JST B2B-XH-A (LF)(SN)  [PCB-s8s8ac3ylnu6waak0fxh-1]
3.3V_CH2  JST B2B-XH-A (LF)(SN)  [PCB-s8s8ac3ylnu6waak0fxh-1]
5V_CH1  JST B2B-XH-A (LF)(SN)  [PCB-s8s8ac3ylnu6waak0fxh-1]  (value not drawn)
5V_CH2  JST B2B-XH-A (LF)(SN)  [PCB-s8s8ac3ylnu6waak0fxh-1]  (value not drawn)
5V_CH3  JST B2B-XH-A (LF)(SN)  [PCB-s8s8ac3ylnu6waak0fxh-1]  (value not drawn)
C1  16V 1uF  [CAPC1005X56X25NL10T15]
C2  16V 1uF  [CAPC1005X56X25NL10T15]
C3  16V 1uF  [CAPC1005X56X25NL10T15]
C4  1µF  [CAPC1608X90X35LL15T15]
C5  1uF  [CAPC1005X56X25NL10T15]
C6  1uF  [CAPC1005X56X25NL10T15]
C7  1uF  [CAPC1005X56X25NL10T15]
C8  10V 22uF  [PCB-l6gghpm6qgmuzlt59psh-1]
C9  10V 22uF  [PCB-l6gghpm6qgmuzlt59psh-1]
C10  10V 22uF  [PCB-l6gghpm6qgmuzlt59psh-1]
C11  10V 22uF  [PCB-l6gghpm6qgmuzlt59psh-1]
C12  10V 22uF  [PCB-l6gghpm6qgmuzlt59psh-1]
Q1  Vishay SI7149ADP-T1-GE3  [PCB-zhz9tig7820limf6j70v-1]  (value not drawn)
Q2  Vishay SISS23DN-T1-GE3  [PCB-3102182-1]  (value not drawn)
Q3  Vishay SISS23DN-T1-GE3  [PCB-3102182-1]  (value not drawn)
Q4  SMMBT4401LT1G  [ONSC-SOT-23-3-318-08_V]  (value not drawn)
Q5  SMMBT4401LT1G  [ONSC-SOT-23-3-318-08_V]  (value not drawn)
Q6  SMMBT4401LT1G  [ONSC-SOT-23-3-318-08_V]  (value not drawn)
Q7  Vishay SISS23DN-T1-GE3  [PCB-3102182-1]  (value not drawn)
Q8  Vishay SISS23DN-T1-GE3  [PCB-3102182-1]  (value not drawn)
Q9  Vishay SISS23DN-T1-GE3  [PCB-3102182-1]  (value not drawn)
Q10  SMMBT4401LT1G  [ONSC-SOT-23-3-318-08_V]  (value not drawn)
Q11  SMMBT4401LT1G  [ONSC-SOT-23-3-318-08_V]  (value not drawn)
Q12  SMMBT4401LT1G  [ONSC-SOT-23-3-318-08_V]  (value not drawn)
Q13  SI2301BDS-T1-E3  [SOT-23-TT3_L]
Q14  SI2301BDS-T1-E3  [SOT-23-TT3_L]
R1  1k  [PCB-imsgvtunp3nvnj2wzwbs-1]
R2  1k  [PCB-imsgvtunp3nvnj2wzwbs-1]
R3  1k  [PCB-imsgvtunp3nvnj2wzwbs-1]
R4  47k  [RESC1005X40X25LL05T10]
R5  47k  [RESC1005X40X25LL05T10]
R6  47k  [RESC1005X40X25LL05T10]
R7  1k  [PCB-imsgvtunp3nvnj2wzwbs-1]
R8  1k  [PCB-imsgvtunp3nvnj2wzwbs-1]
R9  1k  [PCB-imsgvtunp3nvnj2wzwbs-1]
R10  47k  [RESC1005X40X25LL05T10]
R11  47k  [RESC1005X40X25LL05T10]
R12  47k  [RESC1005X40X25LL05T10]
R13  1k  [PCB-imsgvtunp3nvnj2wzwbs-1]
R14  1k  [PCB-imsgvtunp3nvnj2wzwbs-1]
R15  1k  [PCB-imsgvtunp3nvnj2wzwbs-1]
R16  47k  [RESC1005X40X25LL05T10]
R17  47k  [RESC1005X40X25LL05T10]
R18  47k  [RESC1005X40X25LL05T10]
R19  1k  [PCB-imsgvtunp3nvnj2wzwbs-1]
R20  1k  [PCB-imsgvtunp3nvnj2wzwbs-1]
R21  1k  [PCB-imsgvtunp3nvnj2wzwbs-1]
R22  47k  [RESC1005X40X25LL05T10]
R23  47k  [RESC1005X40X25LL05T10]
R24  47k  [RESC1005X40X25LL05T10]
R25  1k  [PCB-imsgvtunp3nvnj2wzwbs-1]
R26  1k  [PCB-imsgvtunp3nvnj2wzwbs-1]
R27  47k  [RESC1005X40X25LL05T10]
R28  47k  [RESC1005X40X25LL05T10]
U1  PCF8574DGVR  [DGV20_L]

### Ports
I2C (harness I2C)

### Harnesses
I2C: SCL, SDA

### Nets
GND: 3.3V_CH1.2 3.3V_CH2.2 5V_CH1.2 5V_CH2.2 5V_CH3.2 C4.2 C8.1 C9.1 C10.1 C11.1 C12.1 Q4.2(E) Q5.2(E) Q6.2(E) Q10.2(E) Q11.2(E) Q12.2(E) R10.1 R11.1 R12.1 R22.1 R23.1 R24.1 U1.6(A0) U1.7(A1) U1.9(A2) U1.15(GND)
VBAT: C1.2 C2.2 C3.2 Q1.S Q2.2(D) Q3.2(D) R4.2 R5.2 R6.2
VCC_3.3V: C4.1 Q13.2 Q14.2 R27.1 R28.1 U1.5(VCC)
VCC_5V: C5.2 C6.2 C7.2 Q7.2(D) Q8.2(D) Q9.2(D) R16.2 R17.2 R18.2
VCC_BAT_CH0: Q1.D
VCC_BAT_CH1: Q2.3(S)
VCC_BAT_CH2: Q3.3(S)
IO_I2C_SCL: U1.2(SCL) ; port I2C.SCL  [project net I2C1_SCL]
IO_I2C_SDA: U1.4(SDA) ; port I2C.SDA  [project net I2C1_SDA]
PWR_CH0: R7.1 U1.10(P0)
PWR_CH1: R8.1 U1.11(P1)
PWR_CH2: R9.1 U1.12(P2)
PWR_CH3: R21.1 U1.14(P3)
PWR_CH4: R19.1 U1.16(P4)
PWR_CH5: R20.1 U1.17(P5)
PWR_CH6: R25.1 R27.2 U1.19(P6)
PWR_CH7: R26.1 R28.2 U1.20(P7)
Net3.3V_CH1_1: 3.3V_CH1.1 C12.2 Q13.3
Net3.3V_CH2_1: 3.3V_CH2.1 C11.2 Q14.3
Net5V_CH1_1: 5V_CH1.1 C10.2 Q9.3(S)
Net5V_CH2_1: 5V_CH2.1 C8.2 Q7.3(S)
Net5V_CH3_1: 5V_CH3.1 C9.2 Q8.3(S)
NetC1_1: C1.1 Q1.G R1.2 R4.1
NetC2_1: C2.1 Q2.1(G) R2.2 R5.1
NetC3_1: C3.1 Q3.1(G) R3.2 R6.1
NetC5_1: C5.1 Q7.1(G) R13.2 R16.1
NetC6_1: C6.1 Q8.1(G) R14.2 R17.1
NetC7_1: C7.1 Q9.1(G) R15.2 R18.1
NetQ4_1: Q4.1(B) R7.2 R10.2
NetQ4_3: Q4.3(C) R1.1
NetQ5_1: Q5.1(B) R8.2 R11.2
NetQ5_3: Q5.3(C) R2.1
NetQ6_1: Q6.1(B) R9.2 R12.2
NetQ6_3: Q6.3(C) R3.1
NetQ10_1: Q10.1(B) R19.2 R22.2
NetQ10_3: Q10.3(C) R13.1
NetQ11_1: Q11.1(B) R20.2 R23.2
NetQ11_3: Q11.3(C) R14.1
NetQ12_1: Q12.1(B) R21.2 R24.2
NetQ12_3: Q12.3(C) R15.1
NetQ13_1: Q13.1 R25.2
NetQ14_1: Q14.1 R26.2

Not connected (* = marked no-connect by the designer): U1 1(~{INT}) 3(NC) 8(NC) 13(NC) 18(NC)

### Notes on the sheet
- (in symbol CMP-ebab2065408c346c-3) 4; 1, 2, 3; 5

### Library data of the parts
3.3V_CH1 3.3V_CH2 5V_CH1-5V_CH3 = CMP-a2a66bdac84f7d61-16: XH Series 2 Position 2.5 mm Pitch Through Hole Top Entry Shrouded Header; Gender: Male; Voltage Rating (AC): 250 V; Lead-Free Status: Lead Free; Insulation Resistance: 1.00 GΩ; Number of Contacts: 2; Contact Resistance: 10.0 mΩ; Current Rating: 3.00 A; Mounting Style: Through Hole, Vertical; RoHS: Compliant; Manufacturer Part Number: B2B-XH-A (LF)(SN); Octopart URL: http://octopart.com/b2b-xh-a+%28lf%29%28sn%29-jst-7753615; Contact Material: Brass; REACH SVHC Compliance: No SVHC; OctopartID: a2a66bdac84f7d61; Contact Plating: Tin
C1-C3 C5-C7 = CMP-126963-2: Cap Ceramic 1uF 10V X5R 20% SMD 0402 85C Paper T/R; Manufacturer Part Number: 0402ZD105MAT2A; Capacitance: 1e-06 F; Lead-Free Status: Lead Free; Voltage Rating (DC): 10.0 V; Capacitance Tolerance: ±20%; Case/Package: 0402; Dielectric Characteristic: X5R; Mounting Style: Surface Mount; Number of Pins: 2; Octopart Url: https://octopart.com/0402zd105mat2a-avx+interconnect+%2F+elco-7158066; OctopartID: dd611406c13502a6; Packaging: Cut Tape (CT); REACH SVHC Compliance: No SVHC; RoHS: Compliant
C4 = CMP-f2f83b8d074c2d3f-6: 0603 1 uF 16 V ±10 % Tolerance X5R SMT Multilayer Ceramic Capacitor; Capacitance Tolerance: ±10%; Lead-Free Status: Lead Free; Voltage Rating (DC): 16.0 V; Dielectric Characteristic: X5R; Mounting Style: Surface Mount; OctopartID: f2f83b8d074c2d3f
C8-C12 = CMP-1dc8d7348becc20f-1: Cap Ceramic 22uF 10V X5R 10% Pad SMD 1206 85C Automotive T/R; Manufacturer Part Number: LMK316ABJ226KLHT; Octopart URL: https://octopart.com/lmk316abj226klht-taiyo+yuden-66499394; Case/Package: 1206; Mounting Style: Surface Mount
Q1 = CMP-ebab2065408c346c-3: Si7149ADP Series 30 V 50 A 50 mOhm Surface Mount P-Channel Mosfet-PowerPAK SO-8
Q2 Q3 Q7-Q9 = CMP-74eabf6acbf3ab2d-1: Si7617DN Series 30 V 12.3 mOhm 3.7 W P-Channel Mosfet - POWERPAK-1212-8; RoHS: Compliant
Q4-Q6 Q10-Q12 = CMP-860861-2: Switching Transistor, NPN Silicon, 3-Pin SOT-23, Pb-Free, Tape and Reel; Lead-Free Status: Lead Free; Lifecycle Status: Active; Octopart Url: https://octopart.com/smmbt4401lt1g-on+semiconductor-17512939; OctopartID: 7accb2cd6641a50b; RoHS: Compliant; Manufacturer Part Number: SMMBT4401LT1G
Q13 Q14 = CMP-a5cd6e462d967a0a-6: Mosfet, P-ch, Vdss -20V, Rds(on) 0.08 Ohm, Id -2.2A, TO-236 (SOT-23), Pd 0.7W, Vgs +/-8V; Power Dissipation: 900 mW; Continuous Drain Current (Ids): -2.20 A; Drain to Source Voltage (Vds): -20.0 V; Drain to Source Resistance (on) (Rds): 100 mΩ; Number of Pins: 3; Packaging: Cut Tape (CT); REACH SVHC Compliance: No SVHC; OctopartID: a5cd6e462d967a0a; Mounting Style: Surface Mount; Octopart URL: https://octopart.com/si2301bds-t1-e3-vishay-42052925; RoHS: Compliant
R1-R3 R7-R9 R13-R15 R19-R21 R25 R26 = CMP-56d29ab4a6068915-1: Res Thick Film 0402 1K Ohm 1% 0.125W(1/8W) ±100ppm/C Pad SMD T/R; Manufacturer Part Number: CRGP0402F1K0; Resistance Tolerance: ±1%
R4-R6 R10-R12 R16-R18 R22-R24 R27 R28 = CMP-1859043-2: Thick Film Resistors - SMD 1/8watt 47Kohms 1% 100ppm High Power; Manufacturer Part Number: CRCW040247K0FKEDHP; Lead-Free Status: Lead Free; Power Rating: 0.063 W; Resistance: 47000.0 Ω; Case/Package: 0402; Octopart Url: https://octopart.com/crcw040247k0fkedhp-vishay+dale-44383189; OctopartID: 3aaef101241de569; Resistance Tolerance: ±1%; RoHS: Compliant
U1 = CMP-4873507-2: Remote 8-Bit I/O Expander for I2C-Bus, 2.5 to 6 V, -40 to 85 degC, 20-pin TVSOP (DGV), Green (RoHS & no Sb/Br); Lead-Free Status: Lead Free; Number of Outputs: 8; Manufacturer Part Number: PCF8574DGVR; Case/Package: TVSOP; Lifecycle Status: Active; Mounting Style: Surface Mount; Octopart Url: https://octopart.com/pcf8574dgvr-texas+instruments-469516; OctopartID: b39b7a96bcf16c5c; Packaging: Reel; RoHS: Compliant

## Sheet sensors.SchDoc
size A4
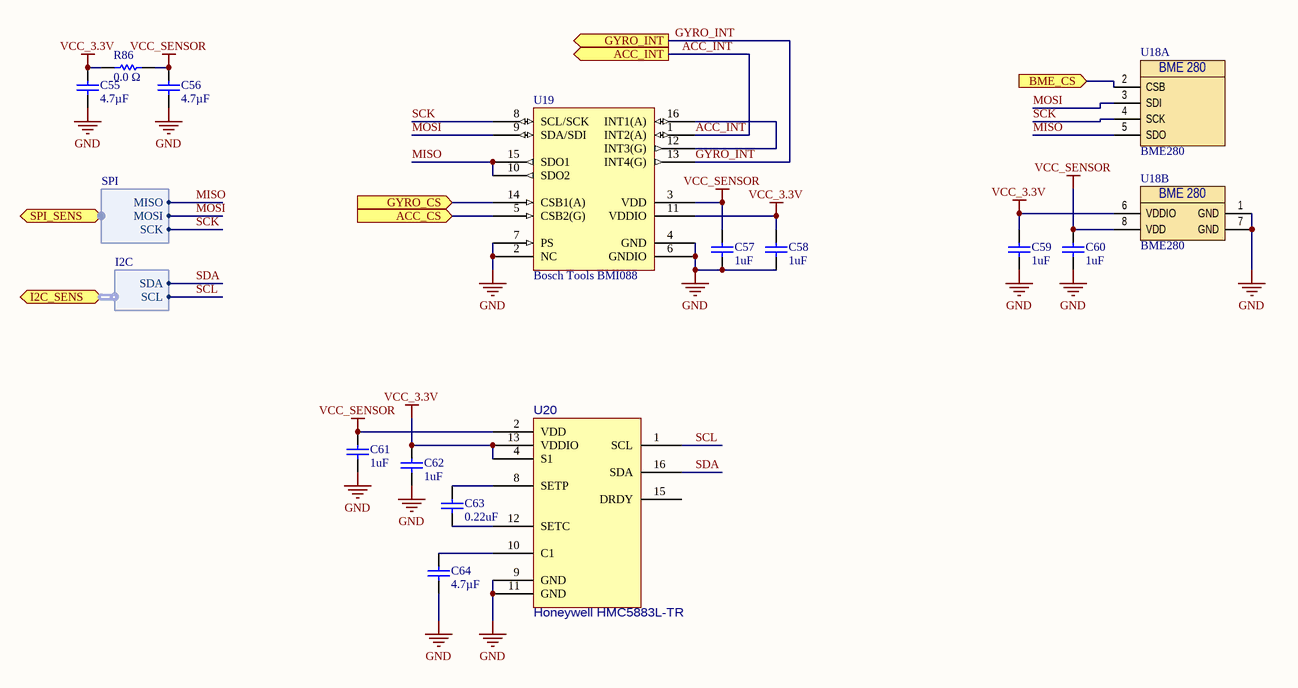
[diagram p3: sensors.SchDoc]

### Parts
C55  4.7µF  [CAPC1608X90X35NL15T15]
C56  4.7µF  [CAPC1608X90X35NL15T15]
C57  1uF  [CAPC1005X56X25NL10T15]
C58  1uF  [CAPC1005X56X25NL10T15]
C59  1uF  [CAPC1005X56X25NL10T15]
C60  1uF  [CAPC1005X56X25NL10T15]
C61  1uF  [CAPC1005X56X25NL10T15]
C62  1uF  [CAPC1005X56X25NL10T15]
C63  0.22uF  [CAPC1005X56X25NL10T15]
C64  4.7µF  [CAPC1608X90X35NL15T15]
R86  0.0 Ω  [RESC1608X55X25LL10T15]
U18  BME280  [PCB-pz4u251hci7fplawf7tn-1]  (parts A,B of 2)
U19  Bosch Tools BMI088  [PCB-rx9ouf6ws7u2trts4ghn-1]
U20  Honeywell HMC5883L-TR  [PCB-2968744-2]

### Ports
ACC_CS (in), ACC_INT (out), BME_CS (in), GYRO_CS (in), GYRO_INT (out), I2C_SENS (harness I2C), SPI_SENS (harness SPI)

### Harnesses
SPI: MOSI, MISO, SCK
I2C: SCL, SDA

### Nets
GND: C55.1 C56.1 C57.1 C58.1 C59.1 C60.1 C61.1 C62.1 C64.2 U18.1(GND) U18.7(GND) U19.2(NC) U19.4(GND) U19.6(GNDIO) U19.7(PS) U20.9(GND) U20.11(GND)
VCC_3.3V: C55.2 C58.2 C59.2 C62.2 R86.2 U18.6(VDDIO) U19.11(VDDIO) U20.4(S1) U20.13(VDDIO)
VCC_SENSOR: C56.2 C57.2 C60.2 C61.2 R86.1 U18.8(VDD) U19.3(VDD) U20.2(VDD)
ACC_CS: U19.5(CSB2(G)) ; port ACC_CS
ACC_INT: U19.1(INT2(A)) ; port ACC_INT
BME_CS: U18.2(CSB) ; port BME_CS
GYRO_CS: U19.14(CSB1(A)) ; port GYRO_CS
GYRO_INT: U19.13(INT4(G)) ; port GYRO_INT
MISO: U18.5(SDO) U19.10(SDO2) U19.15(SDO1) ; port SPI_SENS.MISO
MOSI: U18.3(SDI) U19.9(SDA/SDI) ; port SPI_SENS.MOSI
SCK: U18.4(SCK) U19.8(SCL/SCK) ; port SPI_SENS.SCK
SCL: U20.1(SCL) ; port I2C_SENS.SCL  [project net I2C1_SCL]
SDA: U20.16(SDA) ; port I2C_SENS.SDA  [project net I2C1_SDA]
NetC63_1: C63.1 U20.12(SETC)
NetC63_2: C63.2 U20.8(SETP)
NetC64_1: C64.1 U20.10(C1)
NetU19_12: U19.12(INT3(G)) U19.16(INT1(A))

Not connected (* = marked no-connect by the designer): U20 15(DRDY)

### Notes on the sheet
- (in symbol CMP-19345792-15, part A) BME 280
- (in symbol CMP-19345792-15, part B) BME 280

### Library data of the parts
C55 C56 C64 = CMP-147010-6: as C29 on sheet mcu; Operating Temperature: -55.0 °C to 85.0 °C; Dielectric Characteristic: X5R; OctopartID: 876b4eec68d658ac; Octopart URL: https://octopart.com/cc0603krx5r6bb475-yageo-9292507; Number of Pins: 2; Mounting Style: Surface Mount; RoHS: Compliant
C57-C62 = CMP-126963-2: as C1 on sheet aux_powers; Capacitance Tolerance: ±20%; Case/Package: 0402; Dielectric Characteristic: X5R; Mounting Style: Surface Mount; Number of Pins: 2; Octopart Url: https://octopart.com/0402zd105mat2a-avx+interconnect+%2F+elco-7158066; OctopartID: dd611406c13502a6; Packaging: Cut Tape (CT); REACH SVHC Compliance: No SVHC; RoHS: Compliant
C63 = CMP-126172-3: AVX   04026D224KAT2A   CAP, MLCC, X5R, 220NF, 6.3V, 0402; Capacitance: 2.2e-07 F; Capacitance Tolerance: ±10%; Dielectric Material: Ceramic Multilayer; Lead-Free Status: Lead Free; Mounting Style: Surface Mount; Manufacturer Part Number: 04026D224KAT2A; Number of Pins: 2; Voltage Rating (DC): 6.3 V; Size-Length: 0.001 m; RoHS: Compliant; REACH SVHC Compliance: No SVHC; Case/Package: 0402; Size-Height: 0.00056 m; Octopart Url: https://octopart.com/04026d224kat2a-avx+interconnect+%2F+elco-194761; Dielectric Characteristic: X5R; OctopartID: 3065f96dedcaefa2; Size-Width: 0.0005 m
R86 = CMP-3661350-4: Thick Film Resistors - SMD ZERO OHM JUMPER; Voltage Rating (DC): 50.0 V; Lead-Free Status: Lead Free; Resistance Tolerance: ±5%; Octopart Url: https://octopart.com/rc0603jr-130rl-yageo-9297262; Case/Package: 0603; OctopartID: ee3b27bc163331fc; Resistance: 0.0 Ω
U18 = CMP-19345792-15: Pressure, Temperature and Humidity Sensor Digital Output 1.8V 8-Pin LGA T/R; Lead-Free Status: Lead Free; Octopart URL: https://octopart.com/bme280-bosch+tools-52931981
U19 = CMP-3c8ff0f6eb07e348-2: BMI088 Series 3.6 V 6 Axis Digital Output Accelerometer Motion Sensor - LGA-16; Lead-Free Status: Lead Free; Manufacturer Part Number: BMI088; Octopart URL: https://octopart.com/bmi088-bosch+tools-91484910; OctopartID: 3c8ff0f6eb07e348; RoHS: Compliant
U20 = CMP-2968744-5: MAGNETIC SENSOR ON TAPE AND REEL; Manufacturer Part Number: HMC5883L-TR; Number of Pins: 16; OctopartID: b1a37a0cbc0b6e64; Octopart Url: http://octopart.com/hmc5883l-tr-honeywell-44378318; RoHS: Compliant

## Sheet external_connector.SchDoc
size A4
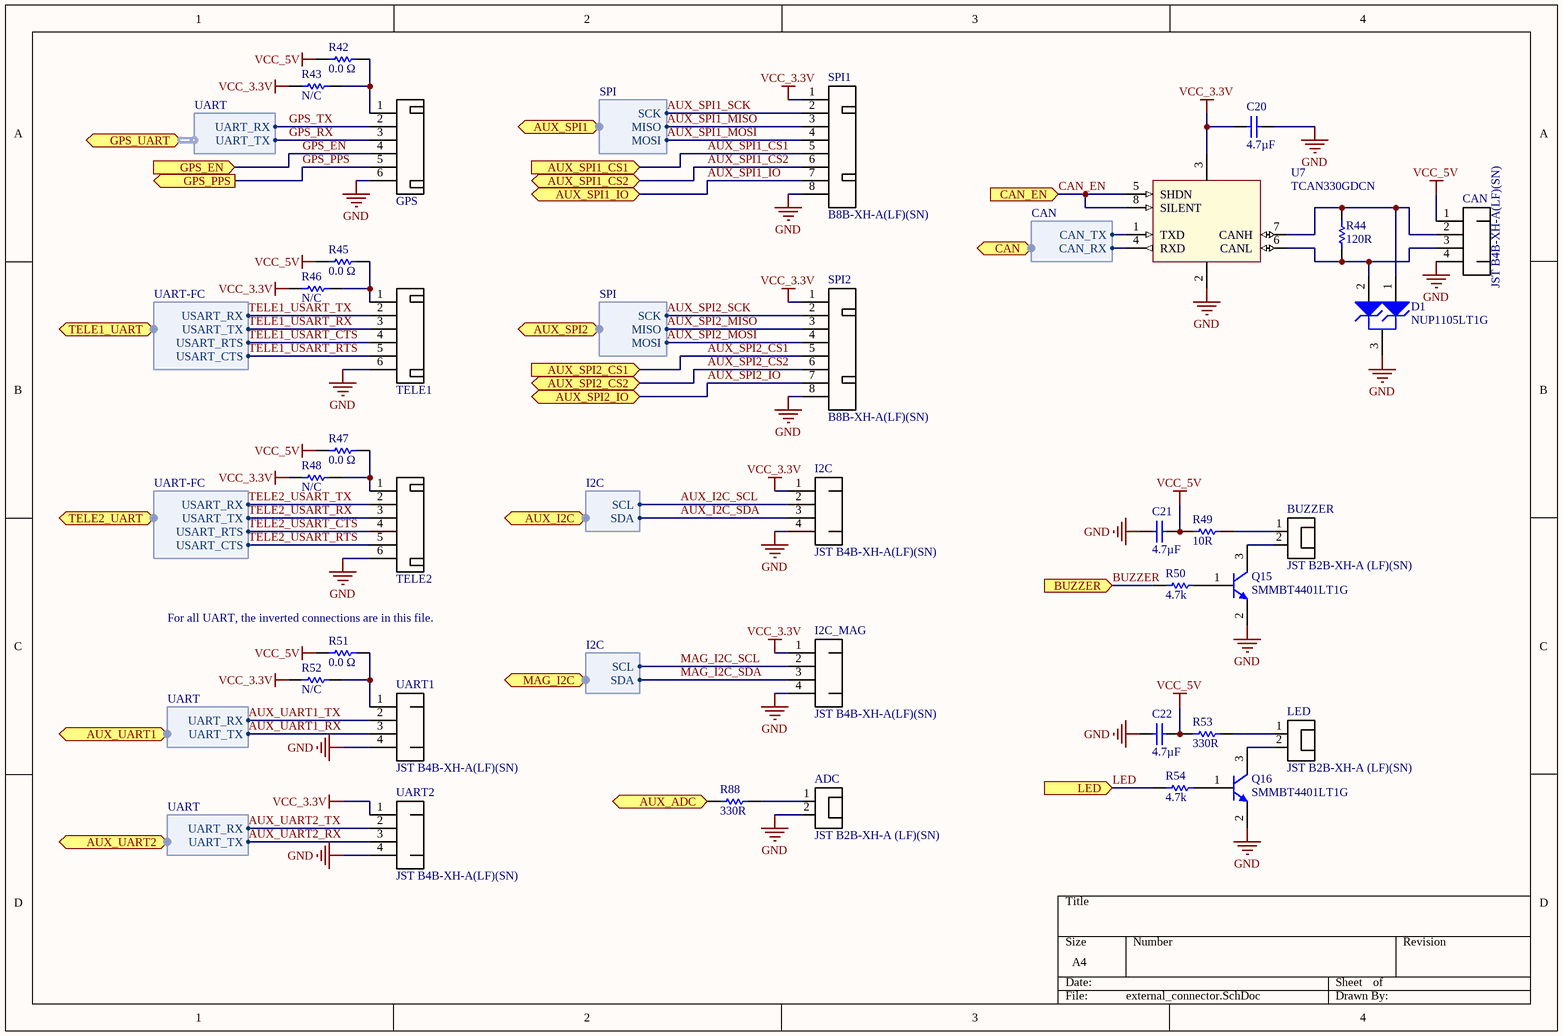
[diagram p4: external_connector.SchDoc]

### Parts
ADC  JST B2B-XH-A (LF)(SN)  [PCB-s8s8ac3ylnu6waak0fxh-1]
BUZZER  JST B2B-XH-A (LF)(SN)  [PCB-s8s8ac3ylnu6waak0fxh-1]
C20  4.7µF  [CAPC1608X90X35NL15T15]
C21  4.7µF  [CAPC1608X90X35NL15T15]
C22  4.7µF  [CAPC1608X90X35NL15T15]
CAN  JST B4B-XH-A(LF)(SN)  [PCB-nwmfqt4y1xdboio0wsyw-1]
D1  NUP1105LT1G  [ONSC-SOT-23-3-318-08_V]
GPS  JST B6B-XH-A(LF)(SN)  [PCB-z7tho54h7p2kc79zj16v-1]  (value not drawn)
I2C  JST B4B-XH-A(LF)(SN)  [PCB-nwmfqt4y1xdboio0wsyw-1]
I2C_MAG  JST B4B-XH-A(LF)(SN)  [PCB-nwmfqt4y1xdboio0wsyw-1]
LED  JST B2B-XH-A (LF)(SN)  [PCB-s8s8ac3ylnu6waak0fxh-1]
Q15  SMMBT4401LT1G  [ONSC-SOT-23-3-318-08_V]
Q16  SMMBT4401LT1G  [ONSC-SOT-23-3-318-08_V]
R42  0.0 Ω  [RESC1608X55X25LL10T15]
R43  N/C  [RESC1608X55X25LL10T15]
R44  120R  [PCB-9ibrwdurth7ekdzjdzvn-1]
R45  0.0 Ω  [RESC1608X55X25LL10T15]
R46  N/C  [RESC1608X55X25LL10T15]
R47  0.0 Ω  [RESC1608X55X25LL10T15]
R48  N/C  [RESC1608X55X25LL10T15]
R49  10R  [RESC1608X06N]
R50  4.7k  [RESC1609X55X30NL10T20]
R51  0.0 Ω  [RESC1608X55X25LL10T15]
R52  N/C  [RESC1608X55X25LL10T15]
R53  330R  [PCB-gqq469mmsoijq124jywu-1]
R54  4.7k  [RESC1609X55X30NL10T20]
R88  330R  [PCB-gqq469mmsoijq124jywu-1]
SPI1  Manufacturer Part Number: B8B-XH-A(LF)(SN)  [PCB-mlv55ck369se549tp0uo-1]  (hidden comment: JST B8B-XH-A(LF)(SN))
SPI2  Manufacturer Part Number: B8B-XH-A(LF)(SN)  [PCB-mlv55ck369se549tp0uo-1]  (hidden comment: JST B8B-XH-A(LF)(SN))
TELE1  JST B6B-XH-A(LF)(SN)  [PCB-z7tho54h7p2kc79zj16v-1]  (value not drawn)
TELE2  JST B6B-XH-A(LF)(SN)  [PCB-z7tho54h7p2kc79zj16v-1]  (value not drawn)
U7  TCAN330GDCN  [PCB-dudqu7qvc0a2juw3nqi5-1]
UART1  JST B4B-XH-A(LF)(SN)  [PCB-nwmfqt4y1xdboio0wsyw-1]
UART2  JST B4B-XH-A(LF)(SN)  [PCB-nwmfqt4y1xdboio0wsyw-1]

### Ports
AUX_ADC (out), AUX_I2C (harness I2C), AUX_SPI1 (harness SPI), AUX_SPI1_CS1 (in), AUX_SPI1_CS2 (bidir), AUX_SPI1_IO (bidir), AUX_SPI2 (harness SPI), AUX_SPI2_CS1 (in), AUX_SPI2_CS2 (bidir), AUX_SPI2_IO (bidir), AUX_UART1 (harness UART), AUX_UART2 (harness UART), BUZZER (in), CAN (harness CAN), CAN_EN (in), GPS_EN (in), GPS_PPS (out), GPS_UART (harness UART), LED (in), MAG_I2C (harness I2C), TELE1_UART (harness UART-FC), TELE2_UART (harness UART-FC)

### Harnesses
I2C: SCL, SDA
UART: UART_TX, UART_RX
UART-FC: USART_TX, USART_RX, USART_CTS, USART_RTS
SPI: MOSI, MISO, SCK
CAN: CAN_TX, CAN_RX

### Nets
GND: ADC.2 C20.2 C21.1 C22.1 CAN.4 D1.3(K) GPS.6 I2C.4 I2C_MAG.4 Q15.2(E) Q16.2(E) SPI1.8 SPI2.8 TELE1.6 TELE2.6 U7.2(GND) UART1.4 UART2.4
VCC_3.3V: C20.1 I2C.1 I2C_MAG.1 R43.2 R46.2 R48.2 R52.2 SPI1.1 SPI2.1 U7.3(VCC) UART2.1
VCC_5V: C21.2 C22.2 CAN.1 R42.2 R45.2 R47.2 R49.1 R51.2 R53.1
ADC_CH5: R88.1 ; port AUX_ADC
AUX_I2C_SCL: I2C.2 I2C_MAG.2 ; port AUX_I2C.SCL  [also labelled MAG_I2C_SCL]
AUX_I2C_SDA: I2C.3 I2C_MAG.3 ; port AUX_I2C.SDA  [also labelled MAG_I2C_SDA]
AUX_SPI1_CS1: SPI1.5 ; port AUX_SPI1_CS1
AUX_SPI1_CS2: SPI1.6 ; port AUX_SPI1_CS2
AUX_SPI1_IO: SPI1.7 ; port AUX_SPI1_IO
AUX_SPI1_MISO: SPI1.3 SPI2.3 ; port AUX_SPI1.MISO  [also labelled AUX_SPI2_MISO]
AUX_SPI1_MOSI: SPI1.4 SPI2.4 ; port AUX_SPI1.MOSI  [also labelled AUX_SPI2_MOSI]
AUX_SPI1_SCK: SPI1.2 SPI2.2 ; port AUX_SPI1.SCK  [also labelled AUX_SPI2_SCK]
AUX_SPI2_CS1: SPI2.5 ; port AUX_SPI2_CS1
AUX_SPI2_CS2: SPI2.6 ; port AUX_SPI2_CS2
AUX_SPI2_IO: SPI2.7 ; port AUX_SPI2_IO
AUX_UART1_RX: UART1.3 ; port AUX_UART1.UART_TX
AUX_UART1_TX: UART1.2 ; port AUX_UART1.UART_RX
AUX_UART2_RX: UART2.3 ; port AUX_UART2.UART_TX
AUX_UART2_TX: UART2.2 ; port AUX_UART2.UART_RX
BUZZER: R50.1 ; port BUZZER
CAN_EN: U7.5(SHDN) U7.8(SILENT) ; port CAN_EN
FDCAN1_RX: U7.4(RXD) ; port CAN.CAN_RX
FDCAN1_TX: U7.1(TXD) ; port CAN.CAN_TX
GPS_EN: GPS.4 ; port GPS_EN
GPS_PPS: GPS.5 ; port GPS_PPS
GPS_RX: GPS.3 ; port GPS_UART.UART_TX
GPS_TX: GPS.2 ; port GPS_UART.UART_RX
LED: R54.1 ; port LED
TELE1_USART_CTS: TELE1.4 ; port TELE1_UART.USART_RTS
TELE1_USART_RTS: TELE1.5 ; port TELE1_UART.USART_CTS
TELE1_USART_RX: TELE1.3 ; port TELE1_UART.USART_TX
TELE1_USART_TX: TELE1.2 ; port TELE1_UART.USART_RX
TELE2_USART_CTS: TELE2.4 ; port TELE2_UART.USART_RTS
TELE2_USART_RTS: TELE2.5 ; port TELE2_UART.USART_CTS
TELE2_USART_RX: TELE2.3 ; port TELE2_UART.USART_TX
TELE2_USART_TX: TELE2.2 ; port TELE2_UART.USART_RX
NetADC_1: ADC.1 R88.2
NetBUZZER_1: BUZZER.1 R49.2
NetBUZZER_2: BUZZER.2 Q15.3(C)
NetCAN_2: CAN.2 D1.1(A1) R44.2 U7.7(CANH)
NetCAN_3: CAN.3 D1.2(A2) R44.1 U7.6(CANL)
NetGPS_1: GPS.1 R42.1 R43.1
NetLED_1: LED.1 R53.2
NetLED_2: LED.2 Q16.3(C)
NetQ15_1: Q15.1(B) R50.2
NetQ16_1: Q16.1(B) R54.2
NetR45_1: R45.1 R46.1 TELE1.1
NetR47_1: R47.1 R48.1 TELE2.1
NetR51_1: R51.1 R52.1 UART1.1

### Notes on the sheet
- (near R51) For all UART, the inverted connections are in this file.

### Library data of the parts
ADC BUZZER LED = CMP-a2a66bdac84f7d61-16: as 3.3V_CH1 on sheet aux_powers; Mounting Style: Through Hole, Vertical; RoHS: Compliant; Manufacturer Part Number: B2B-XH-A (LF)(SN); Octopart URL: http://octopart.com/b2b-xh-a+%28lf%29%28sn%29-jst-7753615; Contact Material: Brass; REACH SVHC Compliance: No SVHC; OctopartID: a2a66bdac84f7d61; Contact Plating: Tin
C20-C22 = CMP-147010-6: as C29 on sheet mcu; Operating Temperature: -55.0 °C to 85.0 °C; Dielectric Characteristic: X5R; OctopartID: 876b4eec68d658ac; Octopart URL: https://octopart.com/cc0603krx5r6bb475-yageo-9292507; Number of Pins: 2; Mounting Style: Surface Mount; RoHS: Compliant
CAN I2C I2C_MAG UART1 UART2 = CMP-2acae3fced1af50d-8: XH Series 4 Position 2.5 mm Pitch Through Hole Crimp Top Entry Shrouded Header; Manufacturer: JST; Manufacturer Part Number: JST B4B-XH-A(LF)(SN)
D1 = CMP-296179-2: Single Line CAN / LIN Bus Protector, 3-Pin SOT-23, Pb-Free, Tape and Reel; Breakdown Voltage: 28.4 V; Lead-Free Status: Lead Free; Case/Package: SOT-23-3; Halogen Free Status: Halogen Free; Lifecycle Status: Active; Number of Pins: 3; Octopart Url: https://octopart.com/nup1105lt1g-on+semiconductor-1412616; OctopartID: 54649d7bff0a8ba3; Packaging: Cut Tape (CT); RoHS: Compliant; Manufacturer Part Number: NUP1105LT1G
GPS TELE1 TELE2 = CMP-f3cb3ac5a78f2c0c-10: Socket; wire-board; male; XH; 2.5mm; PIN: 6; THT; 250V; 3A; -25÷85°C; Number of Contacts: 6; Lead-Free Status: Contains Lead; Manufacturer Part Number: B6B-XH-A
Q15 Q16 = CMP-860861-2: as Q4 on sheet aux_powers; Lifecycle Status: Active; Octopart Url: https://octopart.com/smmbt4401lt1g-on+semiconductor-17512939; OctopartID: 7accb2cd6641a50b; RoHS: Compliant; Manufacturer Part Number: SMMBT4401LT1G
R42 R45 R47 R51 = CMP-3661350-4: as R86 on sheet sensors; Octopart Url: https://octopart.com/rc0603jr-130rl-yageo-9297262; Case/Package: 0603; OctopartID: ee3b27bc163331fc; Resistance: 0.0 Ω
R43 R46 R48 R52 = CMP-3661350-4: Thick Film Resistors - SMD ZERO OHM JUMPER; Voltage Rating (DC): 50.0 V; Lead-Free Status: Lead Free; Resistance Tolerance: ±5%; Resistance: 0.0 Ω; Octopart Url: https://octopart.com/rc0603jr-130rl-yageo-9297262; Case/Package: 0603; OctopartID: ee3b27bc163331fc
R44 = CMP-86e64d9c460d5921-7: Res Thick Film 0805 120 Ohm 1% 0.125W(1/8W) ±100ppm/C Pad SMD T/R; Voltage Rating (DC): 150 V; Lead-Free Status: Lead Free; Temperature Coefficient: -100 ppm/°C to 100 ppm/°C; Power Rating: 125 mW; Number of Pins: 2; OctopartID: 86e64d9c460d5921; Resistance Tolerance: ±1%; Size-Length: 2.00 mm; Size-Height: 500 µm; RoHS: Compliant; Case/Package: 0805; REACH SVHC Compliance: No SVHC
R49 = CMP-3652131-6: Precision resistor, SMD [Panasonic Automotive & Industrial Systems] ERJ3EKF10R0V Precision resistor, SMD; Manufacturer Part Number: ERJ-3EKF10R0V; Resistance Tolerance: ±1%; Lead-Free Status: Lead Free; Case/Package (SI): 1608; Power Rating: 100 mW; Voltage Rating (DC): 75.0 V; Mounting Style: Surface Mount; Size-Height: 450 µm; Lifecycle Status: Not Listed by Manufacturer; OctopartID: 4370893702979cb7; Size-Width: 800 µm; Number of Pins: 2; RoHS: Compliant; Case/Package: 0603; Size-Length: 1.60 mm; Octopart URL: http://octopart.com/erj-3ekf10r0v-panasonic-55403649; Packaging: Tape & Reel (TR), Cut Tape (CT)
R50 R54 = CMP-1863095-2: RES SMD 4.7K OHM 0.1% 1/10W 0603; Manufacturer Part Number: TNPW06034K70BEEA; Lead-Free Status: Lead Free; Power Rating: 0.1 W; Resistance: 4700.0 Ω; Voltage Rating (DC): 75.0 V; Case/Package: 0603; Number of Pins: 2; Octopart Url: https://octopart.com/tnpw06034k70beea-vishay+dale-42338354; OctopartID: 172ddca13a79c8ea; Packaging: Cut Tape (CT); Resistance Tolerance: ±0.1%; RoHS: Compliant
R53 R88 = CMP-1852941-7: as R87 on sheet mcu; Octopart URL: https://octopart.com/rc0603jr-07330rl-yageo-39803615; Size-Height: 450 µm; RoHS: Compliant; Resistance Tolerance: ±5%; Packaging: Tape & Reel; Number of Pins: 2; Mounting Style: Surface Mount; Operating Temperature: 155 °C (max); Size-Width: 800 µm; OctopartID: 0b82c0d7743bd445; Case/Package: 0603
SPI1 SPI2 = CMP-8c2545134b9253e2-2: Connector Header, XH Series, 8 Position, 2.50mm, Through Hole, Press-Fit, Solder, Natural; Manufacturer: JST Sales America Inc.; VALUE: 8P VERT; Insulation Resistance: 1.00 G?; Voltage Rating (AC): 250 V; Gender: Male; Lead-Free Status: Lead Free; Current Rating: 3.00 A; Number of Contacts: 8; Contact Resistance: 10.0 m?; OctopartID: 8c2545134b9253e2; Mounting Style: Through Hole, Vertical; Octopart URL: https://octopart.com/b8b-xh-a%28lf%29%28sn%29-jst-3990225; Contact Plating: Tin, Tin Lead; Operating Temperature: -25.0 °C (min); RoHS: Compliant; REACH SVHC Compliance: No SVHC; Contact Material: Brass
U7 = CMP-a47f694d5ac37bb8-2: 3.3-V CAN Transceivers with CAN FD (Flexible Data Rate) 8-SOT-23 -40 to 125; Manufacturer Part Number: TCAN330GDCNR; Lead-Free Status: Contains Lead; Lifecycle Status: Pre-Release; Operating Temperature: -40.0 °C to 125 °C; Number of Pins: 8; RoHS: Compliant; Case/Package: SOT-23; Octopart URL: https://octopart.com/tcan330gdcnr-texas+instruments-70835162; OctopartID: a47f694d5ac37bb8